# Altium schematic sheet SH3 - SIGNAL CONDITIONING.SchDoc: Science - 6_Servo_and_Encoders
size Letter; DrawnBy: Wolfgang Windholtz; Organization: UW Robotics; Address1: 200 University Avenue; Address2: Waterloo; Address3: Ontario; Address4: Canada N2L 3G6; SheetNumber: 6; SheetTotal: 6
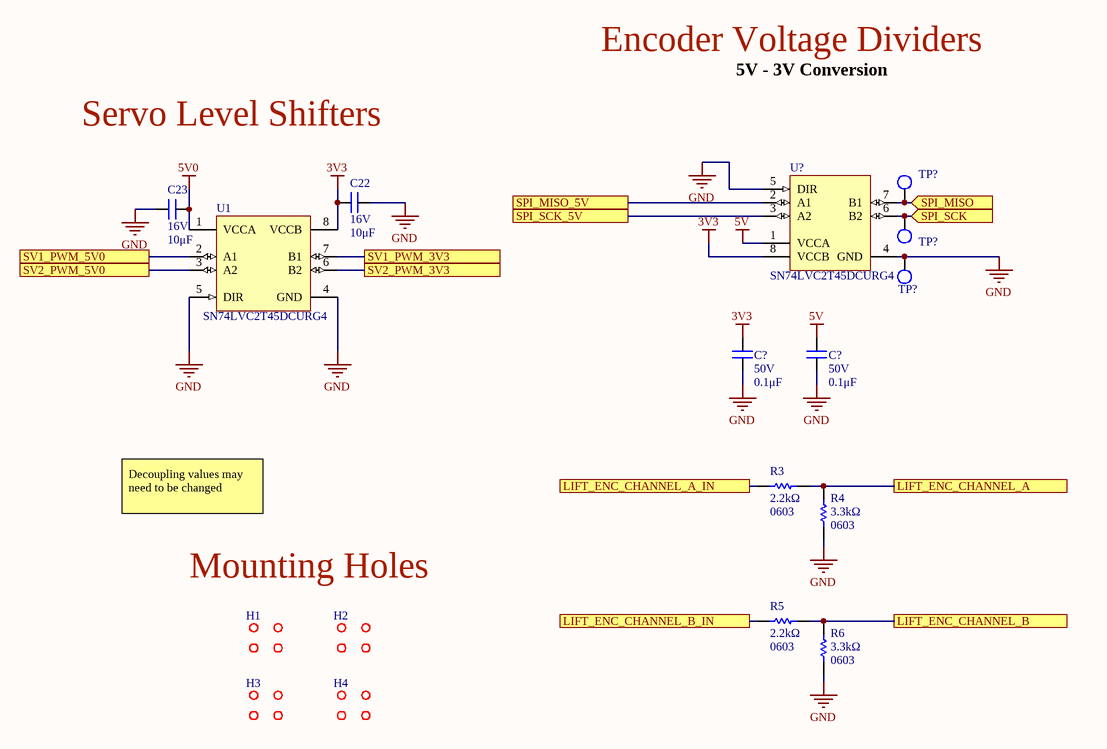
[diagram p0: SH3 - SIGNAL CONDITIONING.SchDoc]

## Parts
(Parts that share a designator on the sheet are numbered #1, #2 ... from top to bottom, then left to right.)
C22  value 10μF  Voltage Rating: 16V  [CAPC0603(1608)55_N]  (hidden comment: CAP_10nF_0603)
C23  value 10μF  Voltage Rating: 16V  [CAPC0603(1608)55_N]  (hidden comment: CAP_10nF_0603)
C?#1  value 0.1μF  Voltage Rating: 50V  [CAPC0603(1608)55_N]  (hidden comment: CAP_0.1uF_50V_0603)
C?#2  value 0.1μF  Voltage Rating: 50V  [CAPC0603(1608)55_N]  (hidden comment: CAP_0.1uF_50V_0603)
H1  MOUNTING_HOLES  [MOUNTING_HOLE]  (value not drawn)
H2  MOUNTING_HOLES  [MOUNTING_HOLE]  (value not drawn)
H3  MOUNTING_HOLES  [MOUNTING_HOLE]  (value not drawn)
H4  MOUNTING_HOLES  [MOUNTING_HOLE]  (value not drawn)
R3  value 2.2kΩ  Case Code (Imperial): 0603  [RESC0603(1608)_N]  (hidden comment: RES_2.2kΩ_0603)
R4  value 3.3kΩ  Case Code (Imperial): 0603  [RESC0603(1608)_N]  (hidden comment: RES_3.3kΩ_0603)
R5  value 2.2kΩ  Case Code (Imperial): 0603  [RESC0603(1608)_N]  (hidden comment: RES_2.2kΩ_0603)
R6  value 3.3kΩ  Case Code (Imperial): 0603  [RESC0603(1608)_N]  (hidden comment: RES_3.3kΩ_0603)
TP?#1  TESTPOINT_LOOP  [TESTPOINT_LOOP]  (value not drawn)
TP?#2  TESTPOINT_LOOP  [TESTPOINT_LOOP]  (value not drawn)
TP?#3  TESTPOINT_LOOP  [TESTPOINT_LOOP]  (value not drawn)
U1  SN74LVC2T45DCURG4  [DCU0008A_L]
U?  SN74LVC2T45DCURG4  [DCU0008A_L]

## Ports
LIFT_ENC_CHANNEL_A, LIFT_ENC_CHANNEL_A_IN, LIFT_ENC_CHANNEL_B, LIFT_ENC_CHANNEL_B_IN, SPI_MISO (in), SPI_MISO_5V, SPI_SCK (in), SPI_SCK_5V, SV1_PWM_3V3, SV1_PWM_5V0, SV2_PWM_3V3, SV2_PWM_5V0

## Nets
3V3: C22.1 C?#1.2 U1.8(VCCB) U?.8(VCCB)
5V: C?#2.2 U?.1(VCCA)
5V0: C23.2 U1.1(VCCA)
GND: C22.2 C23.1 C?#1.1 C?#2.1 R4.1 R6.1 TP?#3.1 U1.4(GND) U1.5(DIR) U?.4(GND) U?.5(DIR)
LIFT_ENC_CHANNEL_A: R3.2 R4.2 ; port LIFT_ENC_CHANNEL_A
LIFT_ENC_CHANNEL_A_IN: R3.1 ; port LIFT_ENC_CHANNEL_A_IN
LIFT_ENC_CHANNEL_B: R5.2 R6.2 ; port LIFT_ENC_CHANNEL_B
LIFT_ENC_CHANNEL_B_IN: R5.1 ; port LIFT_ENC_CHANNEL_B_IN
SPI_MISO: TP?#1.1 U?.7(B1) ; port SPI_MISO
SPI_MISO_5V: U?.2(A1) ; port SPI_MISO_5V
SPI_SCK: TP?#2.1 U?.6(B2) ; port SPI_SCK
SPI_SCK_5V: U?.3(A2) ; port SPI_SCK_5V
SV1_PWM_3V3: U1.7(B1) ; port SV1_PWM_3V3
SV1_PWM_5V0: U1.2(A1) ; port SV1_PWM_5V0
SV2_PWM_3V3: U1.6(B2) ; port SV2_PWM_3V3
SV2_PWM_5V0: U1.3(A2) ; port SV2_PWM_5V0

## Notes on the sheet
- Encoder Voltage Dividers
- 5V - 3V Conversion
- Servo Level Shifters
- Decoupling values may need to be changed
- Mounting Holes
- Title
- Size:
- Date:
- Letter
- Drawn By:
- Sheet
- of
- File:

## Library data of the parts
C22 C23 = CAP_10nF_0603: CAP CER 10000PF 16V X7R 0603; Manufacturer Part Number 1: CC0603KRX7R7BB103; Manufacturer 1: Yageo; Dimensions: 0.063" L x 0.031" W (1.60mm x 0.80mm); Package: 0603 (1608 Metric); Temperature Coefficient: X7R; Supplier Part Number 1: 311-3369-1-ND; Supplier 1: Digi-Key; Mount: Surface Mount; Case Code (Imperial): 0603; Case Code (Metric): 1608; Dielectric: X7R
C?#1 C?#2 = CAP_0.1uF_50V_0603: CAP CER 0.1UF 50V X7R 0603; Manufacturer Part Number 1: CC0603KRX7R9BB104; Manufacturer 1: Yageo; Dimensions: 0.063" L x 0.031" W (1.60mm x 0.80mm); Package: 0603 (1608 Metric); Temperature Coefficient: X7R; Supplier Part Number 1: 311-1344-1-ND; Supplier 1: Digi-Key; Mount: Surface Mount; Case Code (Imperial): 0603; Case Code (Metric): 1608; Dielectric: X7R
H1-H4 = MOUNTING_HOLES: 6cm x 6cm
R3 R5 = RES_2.2kΩ_0603: RES SMD 2.2K OHM 1% 1/10W 0603; Manufacturer 1: Yageo; Manufacturer Part Number 1: RC0603FR-072K2L; Dimensions: 0.063" L x 0.031" W (1.60mm x 0.80mm); Package: 0603 (1608 Metric); Supplier Part Number 1: 311-2.20KHRCT-ND; Supplier 1: Digi-Key; Mount: Surface Mount; Case Code (Metric): 1608; Tolerance: 1%
R4 R6 = RES_3.3kΩ_0603: RES SMD 3.3K OHM 5% 1/10W 0603; Manufacturer 1: Yageo; Manufacturer Part Number 1: RC0603JR-073K3L; Dimensions: 0.063" L x 0.031" W (1.60mm x 0.80mm); Package: 0603 (1608 Metric); Supplier 1: Digi-Key; Supplier Part Number 1: 311-3.3KGRCT-ND; Mount: Surface Mount; Case Code (Metric): 1608; Tolerance: 5%
TP?#1-TP?#3 = TESTPOINT_LOOP: Loop testpoint through-hole pad; Manufacturer Part Number 1: 5002; Manufacturer 1: Keystone Electronics; Supplier Part Number 1: 36-5002-ND; Supplier 1: Digi-Key; Mount: Through Hole
U1 = IC_LVL_SHIFTER: IC BIDIRECTIONAL LEVEL SHIFTER 8-VSSOP; Manufacturer 1: Texas Instruments; tpd @ Nom Voltage(Max)(ns): 17.7,10.3,8.3,7.2; Logic: True; Rating: Military; ICC @ Nom Voltage(Max)(mA): 0.004; Bits(#): 2; 3-State Output: Yes; Schmitt Trigger: No; Technology Family: LVC; Sub-Family: Dual Supply Translator; Output Drive (IOL/IOH)(Max)(mA): 32/-32; Output Type: CMOS; VCC(Max)(V): 5.5; Input Type: CMOS/TTL; F @ Nom Voltage(Max)(Mhz): 150; VCC(Min)(V): 1.65; Voltage(Nom)(V): 1.8,2.5,3.3,5; PackageReference: DCU0008A; Generic Part Number: SN74LVC2T45; DatasheetVersion: SCES516J; Operating Temperature Range(C): -40 to 85; Supplier 1: Digi-Key; Supplier Part Number 1: 296-39213-2-ND; Manufacturer Part Number 1: SN74LVC2T45DCURG4; Mount: Surface Mount
U? = CMP-0859-00013-4: Dual-Bit Dual Supply Transceiver with Configurable Voltage Translation and 3-State Outputs, DCU0008A, LARGE T&R; Manufacturer: Texas Instruments; tpd @ Nom Voltage(Max)(ns): 17.7,10.3,8.3,7.2; Logic: True; Rating: Military; ICC @ Nom Voltage(Max)(mA): 0.004; Bits(#): 2; 3-State Output: Yes; Schmitt Trigger: No; Technology Family: LVC; Sub-Family: Dual Supply Translator; Output Drive (IOL/IOH)(Max)(mA): 32/-32; Output Type: CMOS; VCC(Max)(V): 5.5; Input Type: CMOS/TTL; F @ Nom Voltage(Max)(Mhz): 150; VCC(Min)(V): 1.65; Voltage(Nom)(V): 1.8,2.5,3.3,5; PackageReference: DCU0008A; Generic Part Number: SN74LVC2T45; DatasheetVersion: SCES516J; Operating Temperature Range(C): -40 to 85